# EAGLE design cabin.clock (EAGLE 7.3.0)
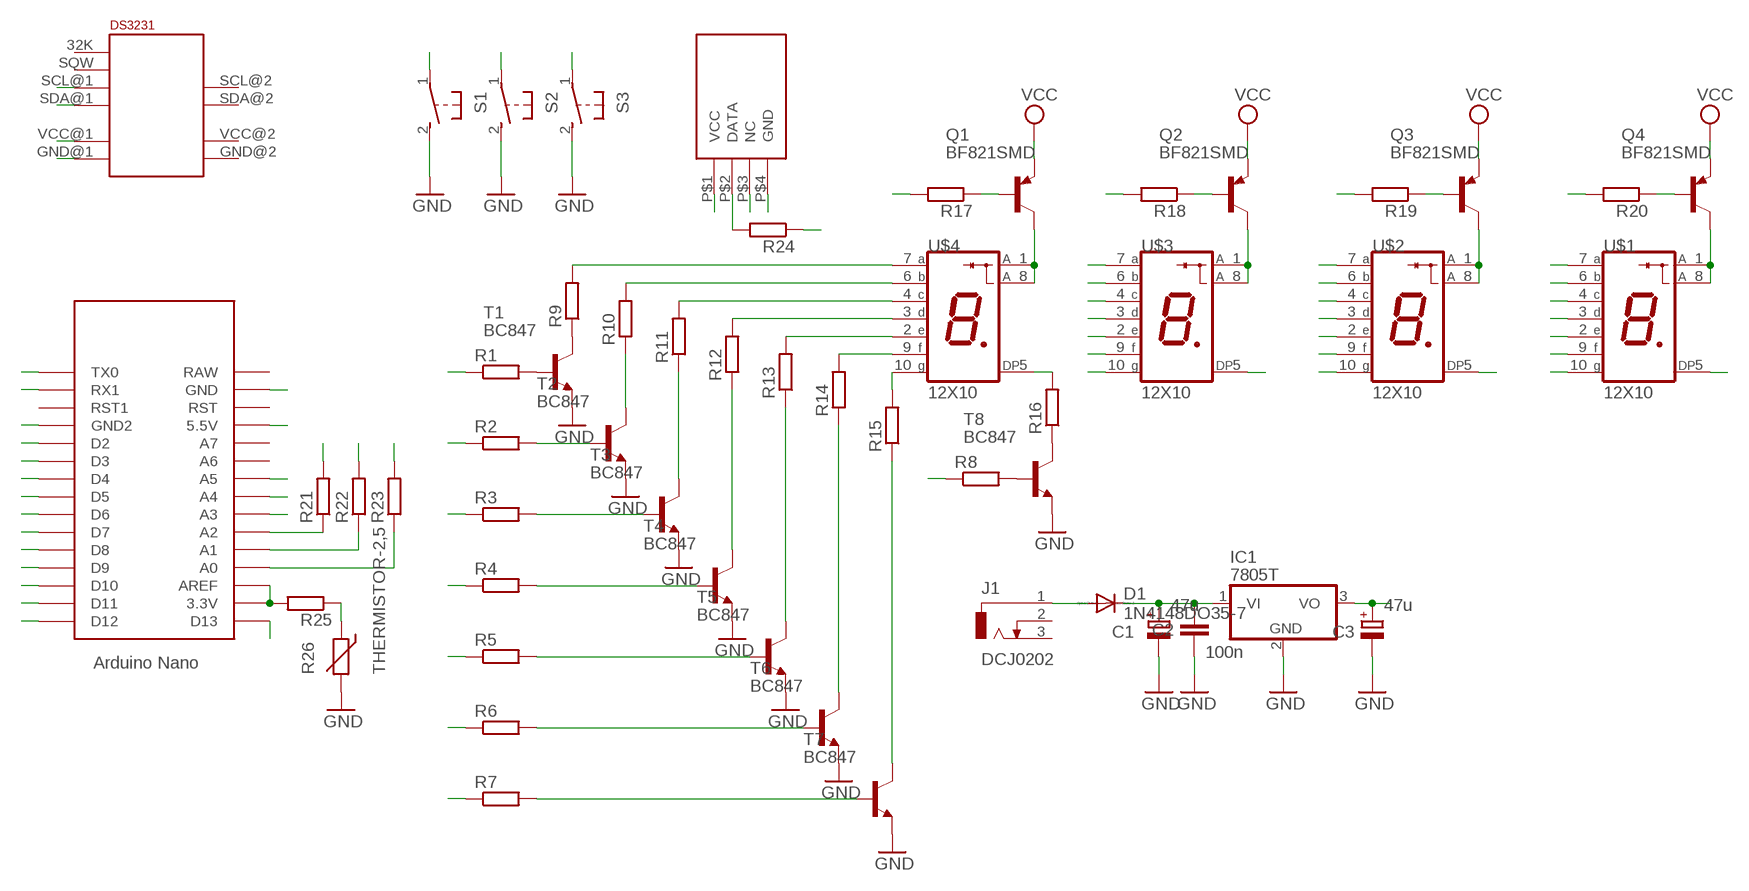
[diagram p0: schematic, sheet 1]

## Parts
C1  47u  CPOL-EUD  [PANASONIC_D]
C2  100n  C-EUC1206  [C1206]
C3  47u  CPOL-EUD  [PANASONIC_D]
D1  1N4148DO35-7  [DO35-7]
IC1  7805T  [TO220H]
J1  DCJ0202  [DCJ0202]
Q1  BF821SMD  [SOT23-BEC]
Q2  BF821SMD  [SOT23-BEC]
Q3  BF821SMD  [SOT23-BEC]
Q4  BF821SMD  [SOT23-BEC]
R1  R-EU_0207/10  [0207/10]
R2  R-EU_0207/10  [0207/10]
R3  R-EU_0207/10  [0207/10]
R4  R-EU_0207/10  [0207/10]
R5  R-EU_0207/10  [0207/10]
R6  R-EU_0207/10  [0207/10]
R7  R-EU_0207/10  [0207/10]
R8  R-EU_0207/10  [0207/10]
R9  R-EU_0207/10  [0207/10]
R10  R-EU_0207/10  [0207/10]
R11  R-EU_0207/10  [0207/10]
R12  R-EU_0207/10  [0207/10]
R13  R-EU_0207/10  [0207/10]
R14  R-EU_0207/10  [0207/10]
R15  R-EU_0207/10  [0207/10]
R16  R-EU_0207/10  [0207/10]
R17  R-EU_0207/10  [0207/10]
R18  R-EU_0207/10  [0207/10]
R19  R-EU_0207/10  [0207/10]
R20  R-EU_0207/10  [0207/10]
R21  R-EU_0207/10  [0207/10]
R22  R-EU_0207/10  [0207/10]
R23  R-EU_0207/10  [0207/10]
R24  R-EU_0207/10  [0207/10]
R25  R-EU_0207/10  [0207/10]
R26  THERMISTOR-2,5  [RS-2,5]
S1  31-XX  [B3F-31XX]
S2  31-XX  [B3F-31XX]
S3  31-XX  [B3F-31XX]
T1  BC847  [SOT23]
T2  BC847  [SOT23]
T3  BC847  [SOT23]
T4  BC847  [SOT23]
T5  BC847  [SOT23]
T6  BC847  [SOT23]
T7  BC847  [SOT23]
T8  BC847  [SOT23]
U$1  12X10  [12X10]
U$2  12X10  [12X10]
U$3  12X10  [12X10]
U$4  12X10  [12X10]
U$5  NANO  [NANO]
U$6  DS3231BOARD  [BOARD]
U$7  DTH21  [DTH21]

## Nets
A: R9.2 U$1.7(A) U$2.7(A) U$3.7(A) U$4.7(A)
A0: R23.1 S1.1(P) U$5.A0
A1: R22.1 S2.1(P) U$5.A1
A2: R21.1 S3.1(P) U$5.A2
A3: R25.1 R26.1 U$5.A3
B: R10.2 U$1.6(B) U$2.6(B) U$3.6(B) U$4.6(B)
C: R11.2 U$1.4(C) U$2.4(C) U$3.4(C) U$4.4(C)
D: R12.2 U$1.3(D) U$2.3(D) U$3.3(D) U$4.3(D)
D2: R3.1 U$5.D2
D3: R4.1 U$5.D3
D4: R5.1 U$5.D4
D5: R6.1 U$5.D5
D6: R7.1 U$5.D6
D7: R8.1 U$5.D7
D8: R17.2 U$5.D8
D9: R18.2 U$5.D9
D10: R19.2 U$5.D10
D11: R20.2 U$5.D11
D12: U$5.D12
D13: R24.2 U$5.D13 U$7.P$2(DATA)
DP: R16.2 U$1.5(DP) U$2.5(DP) U$3.5(DP) U$4.5(DP)
E: R13.2 U$1.2(E) U$2.2(E) U$3.2(E) U$4.2(E)
F: R14.2 U$1.9(F) U$2.9(F) U$3.9(F) U$4.9(F)
G: R15.2 U$1.10(G) U$2.10(G) U$3.10(G) U$4.10(G)
GND: C1.- C2.2 C3.- IC1.2(GND) R26.2 S1.2(S) S2.2(S) S3.2(S) T1.2(E) T2.2(E) T3.2(E) T4.2(E) T5.2(E) T6.2(E) T7.2(E) T8.2(E) U$5.GND U$5.GND1(GND2) U$6.GND@1(GND) U$7.P$4(GND)
N$1: R1.2 T1.1(B)
N$2: R8.2 T8.1(B)
N$3: Q4.C U$1.1(A) U$1.8(A)
N$4: R9.1 T1.3(C)
N$5: Q3.C U$2.1(A) U$2.8(A)
N$6: R16.1 T8.3(C)
N$7: Q2.C U$3.1(A) U$3.8(A)
N$8: Q1.C U$4.1(A) U$4.8(A)
N$9: Q1.B R17.1
N$10: Q2.B R18.1
N$11: Q3.B R19.1
N$12: Q4.B R20.1
N$13: D1.A J1.1
N$14: R25.2 U$5.3.3V U$5.AREF
N$17: U$7.P$3(NC)
N$18: R10.1 T2.3(C)
N$19: R11.1 T3.3(C)
N$20: R12.1 T4.3(C)
N$21: R13.1 T5.3(C)
N$22: R14.1 T6.3(C)
N$23: R15.1 T7.3(C)
N$24: R2.2 T2.1(B)
N$25: R3.2 T3.1(B)
N$26: R4.2 T4.1(B)
N$27: R5.2 T5.1(B)
N$28: R6.2 T6.1(B)
N$29: R7.2 T7.1(B)
RX1: R1.1 U$5.RX1
SCL: U$5.A5 U$6.SCL@1(SCL)
SDA: U$5.A4 U$6.SDA@1(SDA)
TX0: R2.1 U$5.TX0
VCC: C3.+ IC1.3(VO) R21.2 R22.2 R23.2 R24.1 U$5.5V(5.5V) U$6.VCC@1(VCC) U$7.P$1(VCC)
VIN: C1.+ C2.1 D1.C IC1.1(VI) Q1.E Q2.E Q3.E Q4.E ; supply symbol labelled VCC
Unconnected: J1.2 J1.3 U$5.A6 U$5.A7 U$5.RAW U$5.RST U$5.RST1 U$6.32K U$6.SCL@2(SCL) U$6.SDA@2(SDA) U$6.SQW

## Power pins joined to a net without a drawn wire
GND: U$6.GND@2(GND)
VCC: U$6.VCC@2(VCC)

## Library data of the parts
C1 C3 = rcl:CPOL-EU: POLARIZED CAPACITOR, European symbol
C2 = rcl:C-EU: CAPACITOR, European symbol
D1 = diode:1N4148: DIODE high speed (Philips)
IC1 = linear:78*: Positive VOLTAGE REGULATOR Source: http://cache.national.com/ds/LM/LM78L05.pdf http://www.fairchildsemi.com/ds/LM/LM7805.pdf
J1 = con-jack:DCJ0202: DC POWER JACK Source: DCJ0202.pdf; OC_FARNELL: unknown; OC_NEWARK: unknown
Q1-Q4 = transistor-pnp:BF821*: PNP Transistror
R1-R25 = rcl:R-EU_: RESISTOR, European symbol
R26 = varistor:THERMISTOR: THERMISTOR
S1-S3 = switch-omron:31-XX: OMRON SWITCH; MPN: B3F-3100; OC_FARNELL: 959704; OC_NEWARK: 36M3582
T1-T8 = transistor:BC847: NPN TRANSISTOR
U$1-U$4 = led-7-segment:12X10
U$5 = Arduino:NANO: Arduino Nano
U$6 = DS3232M:DS3231BOARD
U$7 = DTH21:DTH21

## Net classes
0 default: width 0.406 mm, drill 0.406 mm, clearance 0.406 mm
1 power: width 0.61 mm, drill 0.406 mm, clearance 0.203 mm
3 power usb: width 0.508 mm, drill 0.406 mm, clearance 0.203 mm

## Board
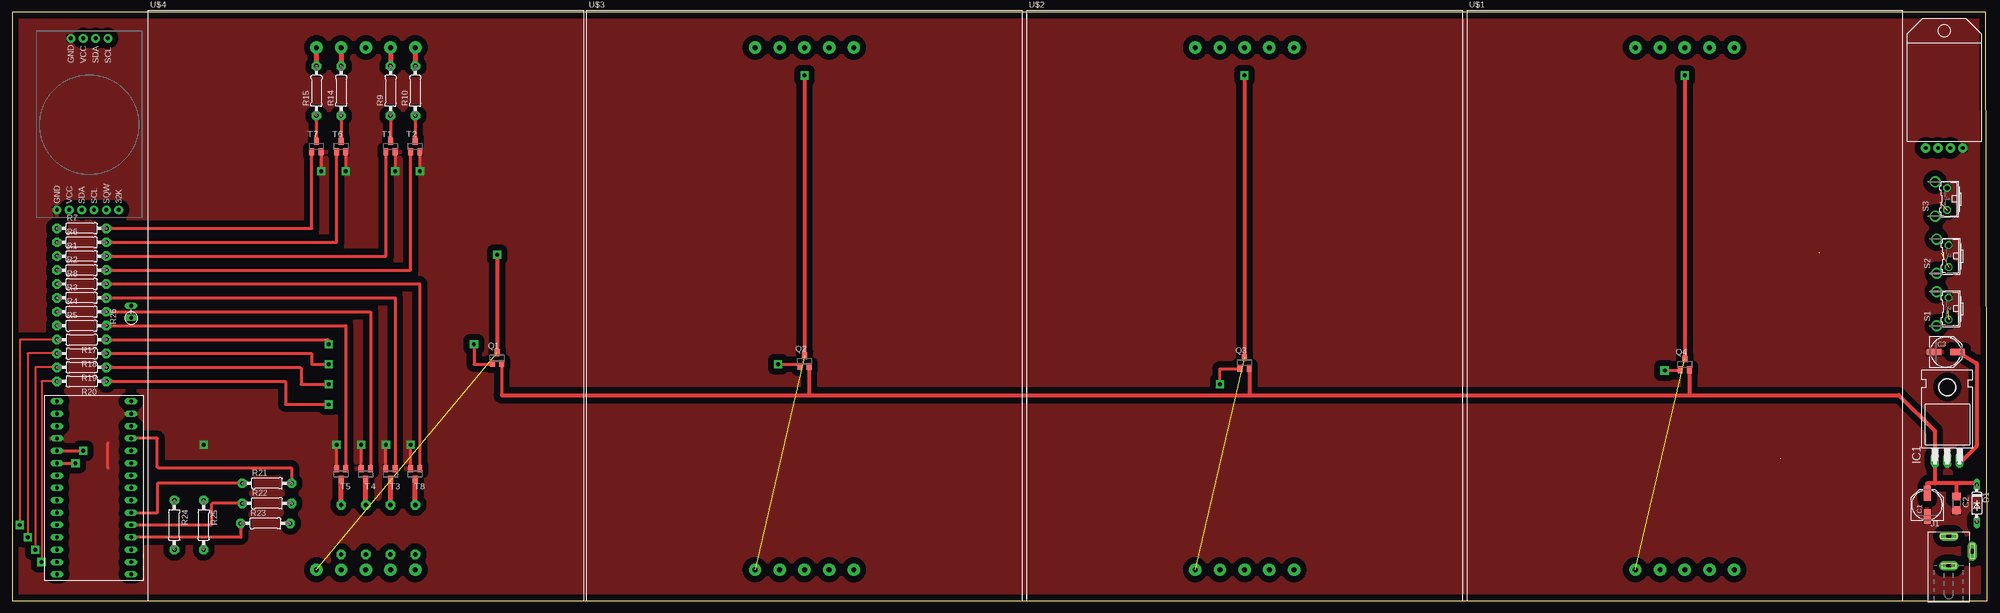
[diagram p1: board, top side]
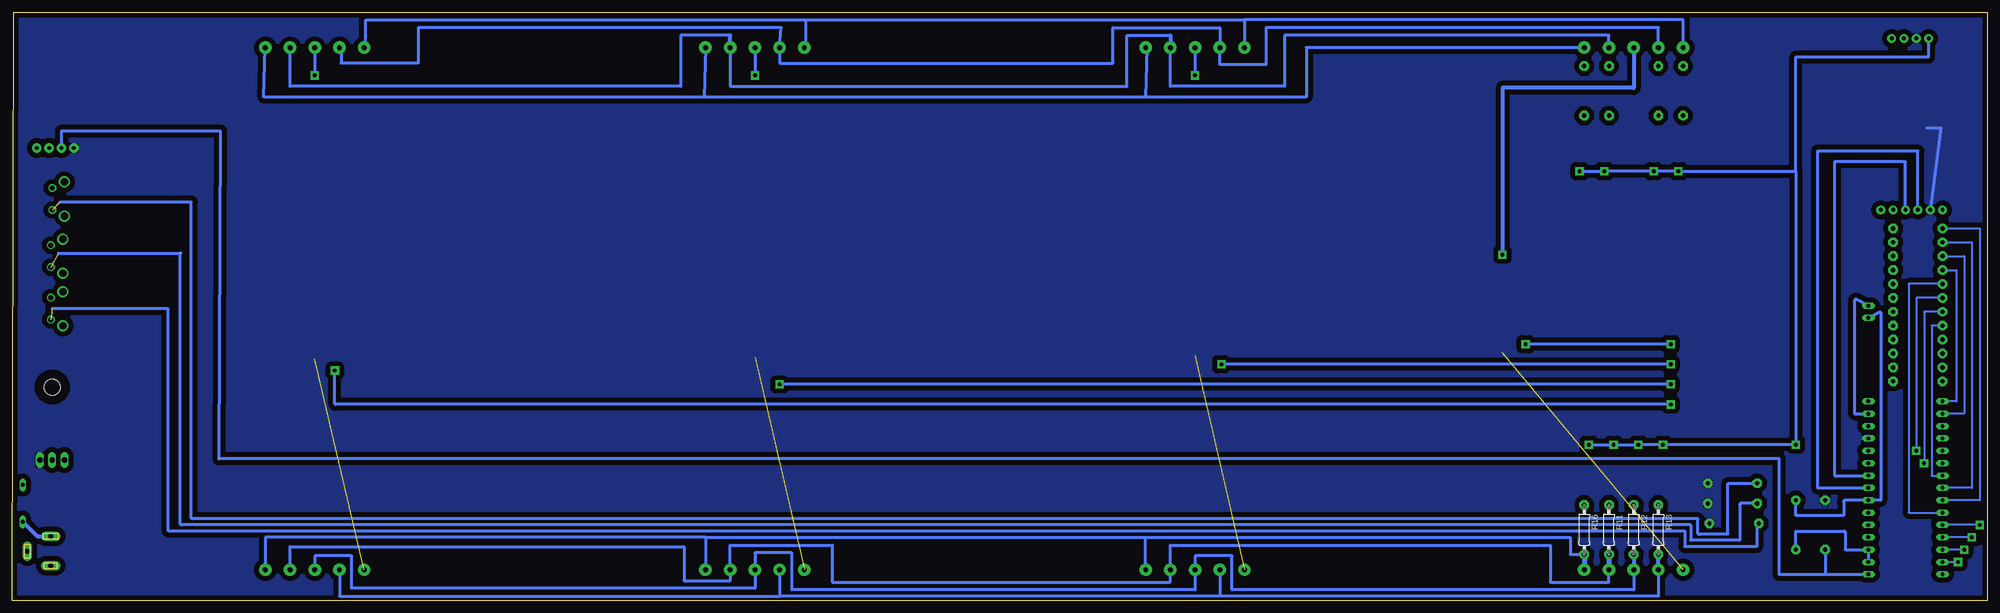
[diagram p2: board, bottom side, seen from below]

Size 406.06 x 120.96 mm. Coordinates in mm from the lower left corner, seen from the top.
Outline: 0,0 406.06,0 405.74,120.96 0,120.96 0,0
Copper layers (1*16): Top 0.035mm / dielectric 1.5mm / Bottom 0.035mm
Design rules "default": minimum track width 10mil, minimum drill 24mil, track to track 8mil, track to pad 8mil, pad to pad 8mil, via to via 8mil, smd to smd 8mil, copper to edge 40mil, drill to drill 8mil, minimum pad ring 10mil, minimum via ring 8mil, stop-mask expansion 4mil, vias tented up to drill 0mil, thermal gap 10mil

### Footprints (pad centres in the part's own frame; a part is rotated, then mirrored left to right if it is on the bottom)
PANASONIC_D = smd 3 x 1.4: + 2.4,0; - -2.4,0
C1206 = smd 1.6 x 1.8: 1 -1.4,0; 2 1.4,0
DO35-7 = drill 0.813 long: A 3.81,0; C -3.81,0
TO220H = drill 1.118 long: 1 -2.54,-10.16; 2 0,-10.16; 3 2.54,-10.16 | hole 3.302: 0,4.826
DCJ0202 = drill 1 pad 2 long: 1 0,3.1; 2 4.8,0; 3 0,-3
SOT23-BEC = smd 1 x 1.4: B -0.95,-1.1; C 0,1.1; E 0.95,-1.1
0207/10 = drill 0.9 pad 1.93 octagon: 1 -5.08,0; 2 5.08,0
RS-2,5 = drill 0.813 long: 1 -1.27,0; 2 1.27,0
B3F-31XX = drill 1.016 octagon: 1 -2.261,-1.245; 2 2.261,-1.245 | drill 1.499 pad 2.159: 3 -3.505,1.245; 4 3.505,1.245
SOT23 = smd 1 x 1.4: 1 -0.95,-1.1; 2 0.95,-1.1; 3 0,1.1
12X10 = drill 1 pad 2.54: 1 34.29,-114.935; 2 39.37,-114.935; 3 44.45,-114.935; 4 49.53,-114.935; 5 54.61,-114.935; 6 54.61,-7.62; 7 49.53,-7.62; 8 44.45,-7.62; 9 39.37,-7.62; 10 34.29,-7.62
NANO = drill 0.8 long: 3.3V -10.16,24.13; 5V -10.16,-1.27; A0 -10.16,19.05; A1 -10.16,16.51; A2 -10.16,13.97; A3 -10.16,11.43; A4 -10.16,8.89; A5 -10.16,6.35; A6 -10.16,3.81; A7 -10.16,1.27; AREF -10.16,21.59; D2 5.08,1.27; D3 5.08,3.81; D4 5.08,6.35; D5 5.08,8.89; D6 5.08,11.43; D7 5.08,13.97; D8 5.08,16.51; D9 5.08,19.05; D10 5.08,21.59; D11 5.08,24.13; D12 5.08,26.67; D13 -10.16,26.67; GND -10.16,-6.35; GND1 5.08,-1.27; RAW -10.16,-8.89; RST -10.16,-3.81; RST1 5.08,-3.81; RX1 5.08,-6.35; TX0 5.08,-8.89
BOARD = drill 0.8 pad 1.778: 32K 16.828,-36.83; GND@1 4.128,-36.83; GND@2 6.985,-1.587; SCL@1 11.748,-36.83; SCL@2 14.605,-1.587; SDA@1 9.207,-36.83; SDA@2 12.065,-1.587; SQW 14.287,-36.83; VCC@1 6.668,-36.83; VCC@2 9.525,-1.587
DTH21 = drill 0.8 pad 1.93: P$1 3.81,-1.27; P$2 6.35,-1.27; P$3 8.89,-1.27; P$4 11.43,-1.27

### Placement (x,y rotation side)
C1  393.7,19.68 90 top
C2  399.73,20 270 top
C3  397.51,51.12 0 top
D1  403.86,20 270 top
IC1  397.83,39.05 0 top
J1  398.15,10.16 0 top
Q1  99.69,49.85 0 top
Q2  162.88,49.21 0 top
Q3  253.36,48.9 0 top
Q4  343.85,48.58 0 top
R1  14.29,70.8 0 top
R2  14.29,67.94 0 top
R3  14.29,62.23 0 top
R4  14.29,59.37 0 top
R5  14.29,56.52 0 top
R6  14.29,73.66 0 top
R7  14.29,76.52 0 top
R8  14.29,65.09 0 top
R9  77.79,104.78 90 top
R10  82.87,104.78 90 top
R11  77.79,14.61 270 bottom
R12  72.71,14.61 270 bottom
R13  67.63,14.61 270 bottom
R14  67.63,104.78 90 top
R15  62.55,104.78 90 top
R16  82.87,14.61 270 bottom
R17  14.29,53.66 180 top
R18  14.29,50.8 180 top
R19  14.29,47.94 180 top
R20  14.29,45.09 180 top
R21  52.39,24.13 0 top
R22  52.39,20 0 top
R23  52.07,15.88 0 top
R24  33.34,15.56 270 top
R25  39.37,15.56 270 top
R26  24.45,59.37 90 top
S1  396.88,60.01 90 top
S2  396.88,70.8 90 top
S3  396.56,82.55 90 top
T1  77.79,93.34 0 top
T2  82.87,93.34 0 top
T3  77.79,26.04 180 top
T4  72.71,26.04 180 top
T5  67.63,26.04 180 top
T6  67.63,93.34 0 top
T7  62.55,93.34 0 top
T8  82.87,26.04 180 top
U$1  299.4,121.28 0 top
U$2  208.91,121.28 0 top
U$3  118.43,121.28 0 top
U$4  28.26,121.28 0 top
U$5  14.29,32.07 180 top
U$6  5.08,117.16 0 top
U$7  389.57,94.3 0 top

### Tracks (layer width: path | path; a pad name or v marks a point on that pad's centre or on a via)
A
  Top 1.016: U$4.7 R9.2
  Bottom 0.61: 258.44,116.21 268.6,116.21 268.6,105.73 348.93,105.73 U$1.7 | U$2.7 258.44,105.73 176.85,105.73 176.85,116.21 167.96,116.21 | U$4.7 77.79,116.21 144.46,116.21 144.46,105.73 167.96,105.73 U$3.7
  Bottom 0.813: U$2.7 258.44,116.21 | 167.96,116.21 U$3.7
A0  (1 unrouted)
  Top 0.61: U$5.A0 46.99,13.02 R23.1
  Bottom 0.61: 397.87,60.01 374.02,60.01 374.02,14.54 arc-90 373.76,14.29 62.34,14.29 arc90 62.23,14.18 62.23,11.11 47.41,11.11 47.41,15.77 arc90 47.31,15.88 R23.1
A1  (2 unrouted)
  Top 0.61: U$5.A1 40.96,15.56 40.96,19.75 arc-90 41.21,20 R22.1
  Bottom 0.61: 371.48,71.5 371.48,15.81 arc-90 371.22,15.56 61.07,15.56 arc90 60.96,15.45 60.96,12.38 50.91,12.38 50.91,19.75 arc90 50.65,20 R22.1 | 396.56,71.44 371.41,71.44
A2  (1 unrouted)
  Top 0.61: U$5.A2 29.84,18.1 29.84,23.88 arc-90 30.1,24.13 R21.1
  Bottom 0.61: 396.24,81.91 369.25,81.91 369.25,17.08 arc-90 369,16.83 59.48,16.83 59.48,13.76 arc-90 59.05,13.65 53.34,13.65 53.34,24.13 R21.1
A3
  Bottom 0.61: R26.1 22.16,59.37 arc90 21.91,59.12 21.91,20.64 U$5.A3 29.27,20.64 arc-90 29.53,20.38 29.53,17.46 39.37,17.46 R25.1
B
  Top 1.016: U$4.6 R10.2
  Bottom 0.61: 172.72,113.66 173.04,103.5 | 173.04,103.5 263.84,103.5 | 263.84,103.5 354.33,103.5 U$1.6 | U$2.6 263.84,103.5 | U$4.6 140.02,113.66 140.02,103.5 173.04,103.5
  Bottom 0.813: U$3.6 172.72,113.66
C
  Bottom 0.61: U$1.4 348.93,11.11 267.97,11.11 267.97,4.13 258.44,4.13 U$2.4 258.44,11.43 237.49,11.43 237.49,3.81 167.96,3.81 U$3.4 167.96,11.43 89.85,11.43 89.85,3.81 77.79,3.81 U$4.4
  Bottom 1.016: R11.2 U$4.4
D
  Bottom 0.61: U$4.3 72.71,2.22 155.26,2.22 155.26,9.21 162.88,9.21 U$3.3 162.88,2.22 245.75,2.22 245.75,9.84 253.36,9.84 U$2.3 253.36,2.54 336.23,2.54 336.23,9.21 343.85,9.21 U$1.3
  Bottom 0.813: R12.2 U$4.3
D2  (via drill 0.8 pad 1.68)
  Top 0.61: U$5.D2 v14.61,30.8
  Bottom 0.406: R3.1 14.61,62.23 v14.61,30.8
D3  (via drill 0.8 pad 1.68)
  Top 0.61: U$5.D3 v13.02,28.26
  Bottom 0.406: R4.1 13.02,59.37 v13.02,28.26
D4
  Bottom 0.406: R5.1 11.43,56.52 11.43,25.72 U$5.D4
D5
  Bottom 0.406: R6.1 3.17,73.66 3.17,23.18 U$5.D5
D6
  Bottom 0.406: R7.1 1.59,76.52 1.59,20.64 U$5.D6
D7
  Bottom 0.406: R8.1 16.19,65.09 16.19,18.1 U$5.D7
D8  (via drill 0.8 pad 1.68)
  Top 0.406: R17.2 1.59,53.66 v1.59,15.56
  Bottom 0.406: v1.59,15.56 U$5.D8
D9  (via drill 0.8 pad 1.68)
  Top 0.406: R18.2 3.17,50.8 v3.17,13.02
  Bottom 0.406: v3.17,13.02 U$5.D9
D10  (via drill 0.8 pad 1.68)
  Top 0.406: R19.2 4.76,47.94 v4.76,10.48
  Bottom 0.406: v4.76,10.48 U$5.D10
D11  (via drill 0.8 pad 1.68)
  Top 0.406: R20.2 6.03,45.09 v6.03,7.94
  Bottom 0.406: v6.03,7.94 U$5.D11
D13  (1 unrouted)
  Bottom 0.61: 363.6,29.21 42.86,29.21 42.86,5.4 33.34,5.4 | 363.54,29.15 363.22,96.52 395.92,96.52 U$7.P$2 | 33.34,5.4 U$5.D13 | R24.2 33.34,5.4
DP
  Bottom 0.61: U$3.5 173.04,13.02 | 173.04,13.02 85.73,13.02 85.73,9.53 R16.2 | 263.53,13.02 173.04,13.02 | 263.53,13.02 U$2.5 | 263.53,13.02 354.01,13.02 U$1.5
  Bottom 1.016: R16.2 U$4.5
E
  Bottom 0.61: U$4.2 67.63,0.95 157.8,0.95 | 157.8,0.95 248.29,0.95 | U$2.2 248.29,0.95 | U$3.2 157.8,0.95 | U$1.2 338.77,0.95 248.29,0.95
  Bottom 0.813: U$4.2 R13.2
F
  Top 1.016: U$4.9 R14.2
  Bottom 0.61: U$4.9 67.63,117.79 148.27,117.79 148.27,110.17 157.8,110.17 U$3.9 157.8,117.79 179.7,117.79 179.7,110.49 248.29,110.49 U$2.9 247.97,117.79 322.58,117.79 322.58,110.49 338.46,110.49 338.46,113.66
  Bottom 0.813: 339.09,113.66 U$1.9 338.46,113.66
G
  Top 1.016: U$4.10 R15.2
  Bottom 0.61: U$4.10 62.55,119.38 152.72,119.38 | 152.72,119.38 U$3.10 | U$2.10 242.89,113.66 242.89,119.38 | 242.89,119.38 152.72,119.38 | 333.37,113.66 333.37,119.38 242.89,119.38
  Bottom 0.813: U$1.10 333.37,113.66
GND  (via drill 0.8 pad 1.68)
  Top 0.61: T7.2 v63.5,88.26 | T6.2 v68.58,88.26 | T1.2 v78.74,88.26 | T2.2 v83.82,88.26 | T5.2 v66.68,32.07 | T4.2 v71.76,32.07 | T3.2 v76.83,32.07 | T8.2 v81.91,32.07 | 19.68,27.3 19.68,32.38 | 39.37,32.38 v39.37,32.07
  Bottom 0.61: v83.82,88.26 v78.74,88.26 v68.58,88.26 v63.5,88.26 39.37,88.26 | v81.91,32.07 v76.83,32.07 v71.76,32.07 v66.68,32.07 v39.37,32.07 39.37,88.26 | 39.37,88.26 39.37,111.76 12.06,111.76 U$6.GND@2 | R26.2 27.05,61.91 arc-90 27.31,61.66 27.31,38.42 U$5.GND
  pour Top (isolate 1.27): 0.32,124.46 407.1,124.46 arc-90 407.35,124.21 407.35,-4.45 0.57,-4.45 arc-90 0.32,-4.19
N$1
  Top 0.61: R1.2 76.84,70.8 T1.1
N$2
  Top 0.61: R8.2 83.82,65.09 T8.1
N$3  (via drill 0.8 pad 1.68)  (1 unrouted)
  Top 0.813: v343.85,107.95 Q4.C
  Bottom 0.61: U$1.8 v343.85,107.95
N$4
  Top 0.61: R9.1 T1.3
N$5  (via drill 0.8 pad 1.68)  (1 unrouted)
  Top 0.813: v253.36,107.95 Q3.C
  Bottom 0.61: U$2.8 v253.36,107.95
N$6
  Top 1.016: R16.1 T8.3
N$7  (via drill 0.8 pad 1.68)  (1 unrouted)
  Top 0.813: v162.88,107.95 Q2.C
  Bottom 0.61: U$3.8 v162.88,107.95
N$8  (via drill 0.8 pad 1.68)  (1 unrouted)
  Top 0.813: v99.69,71.12 Q1.C
  Bottom 0.813: U$4.8 72.71,105.41 99.69,105.41 v99.69,71.12
N$9  (via drill 0.8 pad 1.68)
  Top 0.61: v94.93,52.7 94.93,48.58 98.57,48.58 arc90 Q1.B | R17.1 64.83,53.66 arc-90 65.09,53.4 v65.09,52.7
  Bottom 0.61: v65.09,52.7 v94.93,52.7
N$10  (via drill 0.8 pad 1.68)
  Top 0.61: v157.48,48.58 161.93,48.58 Q2.B | R18.1 61.34,50.8 arc-90 61.59,50.55 61.59,48.58 v65.09,48.58
  Bottom 0.61: v65.09,48.58 v157.48,48.58
N$11  (via drill 0.8 pad 1.68)
  Top 0.61: v248.29,44.45 248.29,47.62 252.41,47.62 Q3.B | R19.1 59.12,47.94 arc-90 59.37,47.69 59.37,44.45 v65.09,44.45
  Bottom 0.61: v65.09,44.45 v248.29,44.45
N$12  (via drill 0.8 pad 1.68)
  Top 0.61: v339.73,47.31 342.73,47.31 arc90 Q4.B | R20.1 55.94,45.09 arc-90 56.2,44.83 56.2,40.32 v65.09,40.32
  Bottom 0.61: v65.09,40.32 339.47,40.32 arc90 339.73,40.58 v339.73,47.31
N$13
  Bottom 0.813: D1.A 401,13.33 arc-45 400.82,13.26 J1.1
N$14
  Bottom 0.61: U$5.3.3V U$5.AREF 29.21,10.48 29.21,14.03 arc-90 29.46,14.29 39.37,14.29 R25.2
N$18
  Top 0.61: R10.1 T2.3
N$19
  Top 1.016: R11.1 T3.3
N$20
  Top 1.016: R12.1 T4.3
N$21
  Top 1.016: R13.1 T5.3
N$22
  Top 0.61: R14.1 T6.3
N$23
  Top 0.61: R15.1 T7.3
N$24
  Top 0.61: R2.2 81.92,67.94 T2.1
N$25
  Top 0.61: R3.2 78.74,62.23 T3.1
N$26
  Top 0.61: R4.2 73.66,59.37 T4.1
N$27
  Top 0.61: R5.2 68.58,56.52 T5.1
N$28
  Top 0.61: R6.2 66.68,73.66 T6.1
N$29
  Top 0.61: R7.2 61.6,76.52 T7.1
RX1
  Bottom 0.406: R1.1 4.76,70.8 4.76,38.42 U$5.RX1
SCL
  Bottom 0.61: U$6.SCL@1 16.83,90.17 31.43,90.17 31.43,25.72 U$5.A5
SDA
  Bottom 0.61: U$6.SDA@1 14.29,92.39 34.92,92.39 34.92,23.18 U$5.A4
TX0
  Bottom 0.406: R2.1 6.35,67.94 6.35,40.96 U$5.TX0
VCC
  Top 0.61: R21.2 57.47,27.05 arc90 57.21,27.3 30.1,27.3 arc-90 29.84,27.56 29.84,33.34 U$5.5V
  Top 0.813: C3.+ 403.79,48.83 arc-45 403.86,48.65 403.86,31.75 401.08,28.97 arc-45 400.9,28.89 IC1.3
  Bottom 0.61: 12.38,97.16 9.52,97.16 U$6.VCC@1
  Bottom 0.813: IC1.3 400.37,28.26
  pour Bottom (isolate 1.016): 0.32,121.28 407.1,121.28 arc-90 407.35,124.84 406.72,-0.32 0.57,-0.32 arc-90 0.32,-4.19
VIN
  Top 0.61: Q1.E 100.65,48.43 100.65,42.23
  Top 0.813: 100.65,42.23 163.83,42.23 | 163.83,42.23 254.32,42.23 | 254.32,42.23 344.8,42.23 | 344.8,42.23 387.88,42.23 395.21,34.89 arc-45 395.29,34.71 IC1.1 395.29,24.13 | Q2.E 163.83,42.23 | Q3.E 254.32,42.23 | Q4.E 344.8,42.23 | D1.C 403.62,24.06 arc45 403.44,24.13 399.73,24.13 | 399.73,24.13 395.29,24.13 | 395.29,24.13 393.7,24.13 C1.+ | C2.1 399.73,24.13